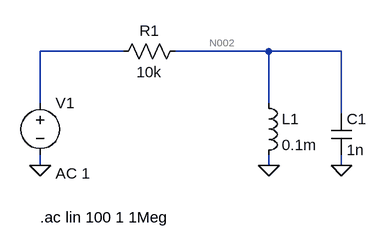
[diagram p0: schematic Sweep_LTspice.asc]
Sweep_LTspice.asc, the LTspice schematic file:
Version 4
SHEET 1 944 680
WIRE -160 -96 -288 -96
WIRE 64 -96 -80 -96
WIRE 176 -96 64 -96
WIRE -288 -16 -288 -96
WIRE 64 -16 64 -96
WIRE 176 0 176 -96
WIRE -288 80 -288 64
WIRE 64 80 64 64
WIRE 176 80 176 64
FLAG 64 80 0
FLAG 176 80 0
FLAG -288 80 0
SYMBOL res -64 -112 R90
WINDOW 0 0 56 VBottom 2
WINDOW 3 32 56 VTop 2
SYMATTR InstName R1
SYMATTR Value 10k
SYMBOL ind 48 -32 R0
SYMATTR InstName L1
SYMATTR Value 0.1m
SYMBOL cap 160 0 R0
SYMATTR InstName C1
SYMATTR Value 1n
SYMBOL voltage -288 -32 R0
WINDOW 123 24 124 Left 2
WINDOW 39 0 0 Left 2
SYMATTR InstName V1
SYMATTR Value ""
SYMATTR Value2 AC 1
TEXT -288 160 Left 2 !.ac lin 100 1 1Meg

The netlist it stands for:
* Sweep_LTspice.asc
R1 N002 N001 10k
L1 N002 0 0.1m
C1 N002 0 1n
V1 N001 0 AC 1
.ac lin 100 1 1Meg
.backanno
.end

* Results of the author's LTspice run, read from the files saved beside the schematic
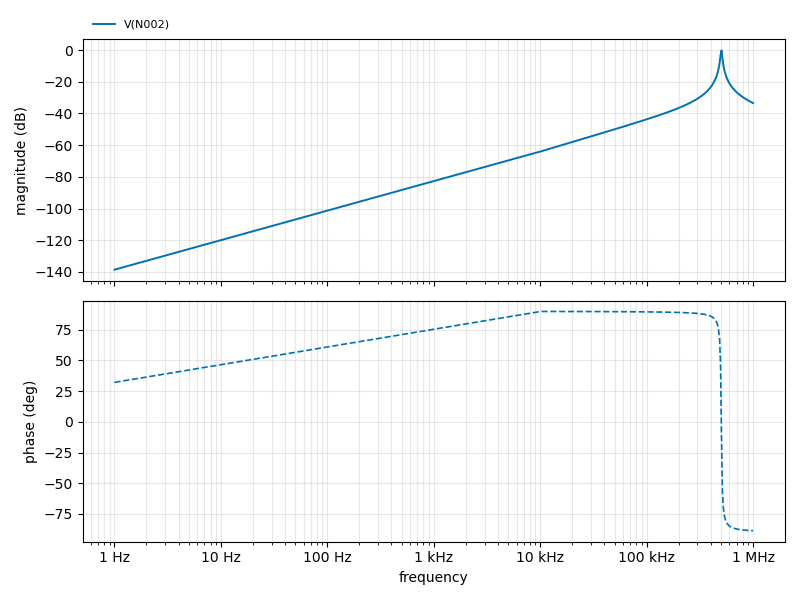
[diagram p1: AC Analysis of Sweep_LTspice.asc, plotted from the saved traces]
* AC Analysis, 1 run:
*   V(N002): -138.55 dB at 1 Hz, -33.43 dB at 1 MHz, peak -0.21 dB at 505.1 kHz, 3 dB below the peak at 495.1 kHz and 511.4 kHz